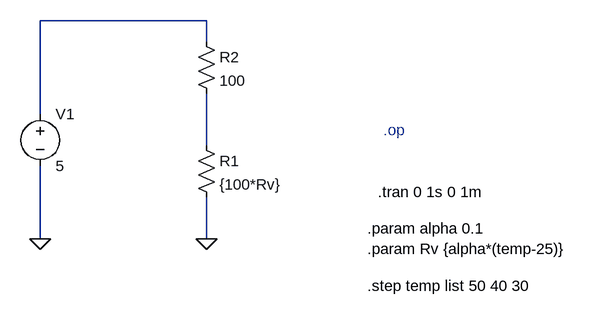
[diagram p0: schematic Draft7.asc]
Draft7.asc, the LTspice schematic file:
Version 4
SHEET 1 920 680
WIRE 256 160 0 160
WIRE 256 192 256 160
WIRE 0 304 0 160
WIRE 256 352 256 272
WIRE 0 496 0 384
WIRE 256 496 256 432
FLAG 256 496 0
FLAG 0 496 0
SYMBOL voltage 0 288 R0
SYMATTR InstName V1
SYMATTR Value 5
SYMBOL res 240 336 R0
SYMATTR InstName R1
SYMATTR Value {100*Rv}
SYMBOL res 240 176 R0
SYMATTR InstName R2
SYMATTR Value 100
TEXT 504 568 Left 2 !.step temp list 50 40 30
TEXT 520 424 Left 2 !.tran 0 1s 0 1m
TEXT 504 480 Left 2 !.param alpha 0.1\n.param Rv {alpha*(temp-25)}
TEXT 528 328 Left 2 ;.op

The netlist it stands for:
* Draft7.asc
V1 N001 0 5
R1 N002 0 {100*Rv}
R2 N001 N002 100
.step temp list 50 40 30
.tran 0 1s 0 1m
.param alpha 0.1
.param Rv {alpha*(temp-25)}
* .op
.backanno
.end